# EAGLE design Lipmouse_Daughterboard_FSRextern (EAGLE 6.6.0)
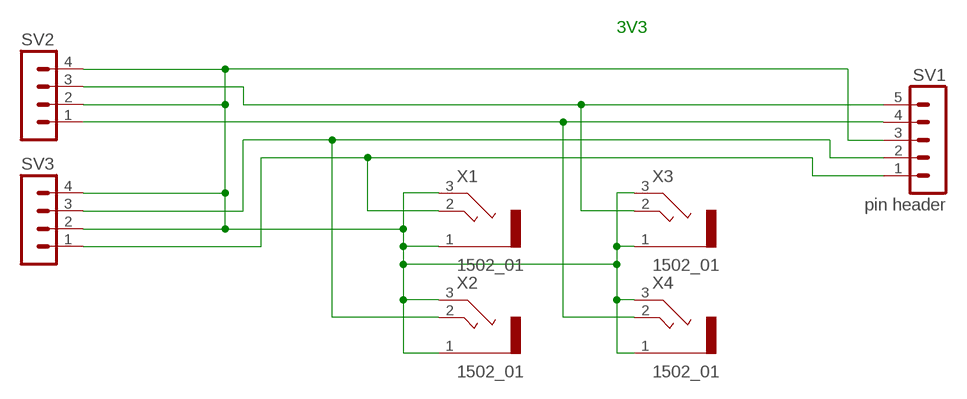
[diagram p0: schematic, sheet 1]

## Parts
SV1  pin header  MA05-1  [MA05-1]
SV2  MA04-1  [MA04-1]
SV3  MA04-1  [MA04-1]
X1  1502_01  [1502_01]
X2  1502_01  [1502_01]
X3  1502_01  [1502_01]
X4  1502_01  [1502_01]

## Nets
3V3: SV1.3 SV2.2 SV2.4 SV3.2 SV3.4 X1.1 X1.3 X2.1 X2.3 X3.1 X3.3 X4.1 X4.3
N$1: SV1.4 SV2.1 X4.2
N$2: SV1.5 SV2.3 X3.2
N$22: SV1.2 SV3.3 X2.2
N$23: SV1.1 SV3.1 X1.2

## Notes on the sheet
- 3V3

## Library data of the parts
SV1 = con-lstb:MA05-1: PIN HEADER; OC_FARNELL: unknown; OC_NEWARK: unknown
SV2 SV3 = con-lstb:MA04-1: PIN HEADER; OC_FARNELL: unknown; OC_NEWARK: unknown
X1-X4 = con-lumberg:1502_01: Jack connectors according to JISC 6560, 3.5 mm Klinkensteckverbinder nach JISC 6560, 3,5 mm Source: http://www.lumberg.com/Produkte/PDFs/1502_01.pdf; OC_FARNELL: 4739747; OC_NEWARK: unknown

## Board
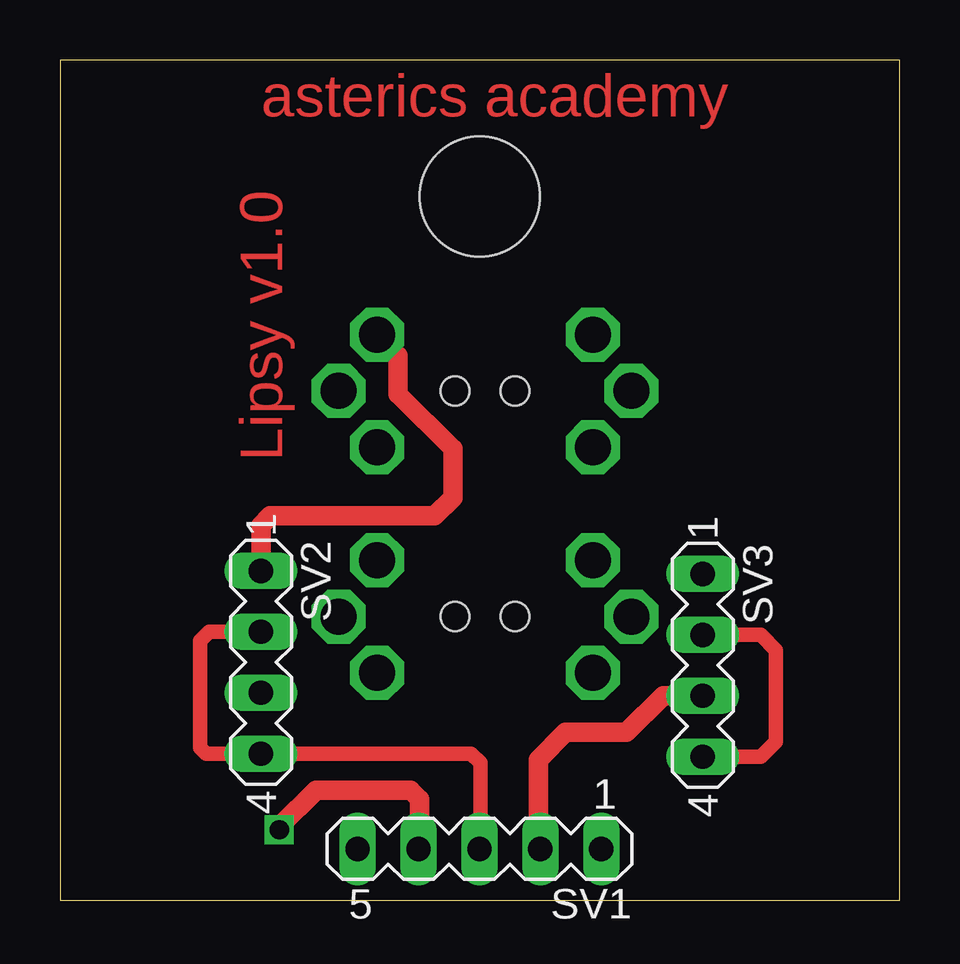
[diagram p1: board, top side]
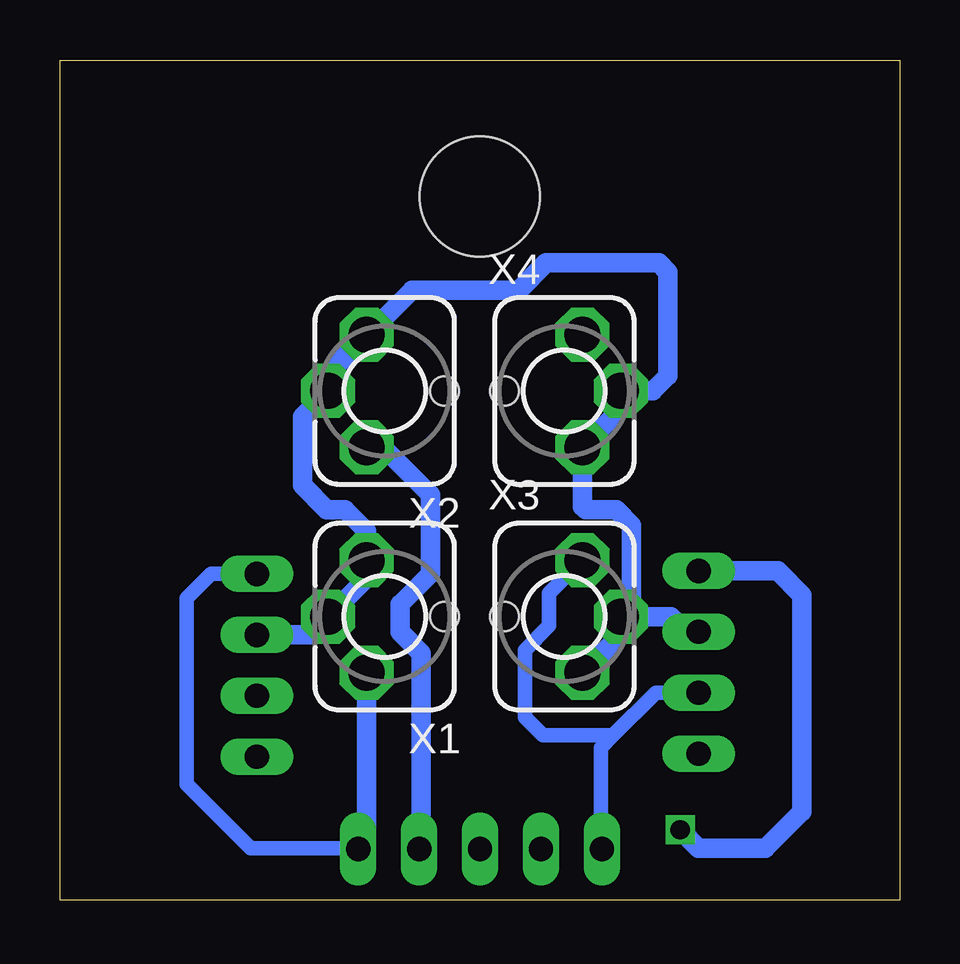
[diagram p2: board, bottom side, seen from below]

Size 35 x 35 mm. Coordinates in mm from the lower left corner, seen from the top.
Outline: 0,0 35,0 35,35 0,35 0,0
Copper layers (1*16): Top 0.035mm / dielectric 1.5mm / Bottom 0.035mm
Design rules "default *": minimum track width 10mil, minimum drill 0.6mm, track to track 8mil, track to pad 8mil, pad to pad 8mil, via to via 8mil, smd to smd 8mil, copper to edge 10mil, drill to drill 8mil, minimum pad ring 6mil, minimum via ring 8mil, stop-mask expansion 4mil, vias tented up to drill 0mil, thermal gap 10mil
Holes 5 mm at 17.5,29.31

### Footprints (pad centres in the part's own frame; a part is rotated, then mirrored left to right if it is on the bottom)
MA05-1 = drill 1.016 long: 1 -5.08,0; 2 -2.54,0; 3 0,0; 4 2.54,0; 5 5.08,0
MA04-1 = drill 1.016 long: 1 -3.81,0; 2 -1.27,0; 3 1.27,0; 4 3.81,0
1502_01 = drill 1.5 pad 1.9 octagon: 1 0,2.35; 2 -2.35,0.75; 3 2.35,0.75 | hole 1.2: 0,-2.5

### Placement (x,y rotation side)
SV1  17.49,2.13 180 top
SV2  8.38,9.91 270 top
SV3  26.8,9.78 270 top
X1  21.46,11.81 90 bottom
X2  21.46,21.21 90 bottom
X3  13.97,11.81 270 bottom
X4  13.97,21.21 270 bottom

### Tracks (layer width: path | path; a pad name or v marks a point on that pad's centre or on a via)
3V3
  Top 0.61: SV2.2 6.22,11.18 5.84,10.79 5.84,6.35 6.1,6.1 SV2.4 17.14,6.1 17.53,5.71 17.53,2.17 SV1.3 | SV3.2 29.21,11.05 29.84,10.41 29.84,6.6 29.21,5.97 SV3.4
  Bottom 0.61: 17.53,2.17 SV1.3
  Bottom 0.813: X2.1 23.81,21.96 X2.3 | X2.1 23.81,21.91 20.32,25.4 15.88,25.4 14.73,26.54 10.03,26.54 9.65,26.16 9.65,21.84 10.29,21.21 X4.1 11.62,20.46 X4.3 13.22,16.39 13.08,16.26 11.81,16.26 11.18,15.62 11.18,12.26 X3.1 | SV3.2 24.57,11.05 X1.1 22.21,13.41 X1.3 22.21,15.36 23.11,16.26 23.88,16.26 24.89,17.27 24.89,20.13 X2.1 | X3.1 11.62,11.06 X3.3 | X3.1 9.53,11.81 8.89,11.18 SV2.2
N$1  (via drill 0.8)
  Top 0.813: v9.14,2.92 9.14,3.05 10.67,4.57 14.61,4.57 14.99,4.19 14.99,2.17 SV1.4 | SV2.1 8.38,15.62 8.76,16 15.62,16 16.38,16.76 16.38,18.8 14.1,21.08 14.1,22.68 X4.2
  Bottom 0.813: SV2.1 5.08,13.72 4.06,12.7 4.06,3.68 5.59,2.16 8.38,2.16 v9.14,2.92
N$2
  Bottom 0.61: SV2.3 10.16,8.64 11.94,6.86 | 11.94,6.86 12.45,6.35 12.45,2.17 SV1.5 | 11.94,6.86 14.86,6.86 15.62,7.62 15.62,10.41 14.61,11.43 14.61,12.78 X3.2
N$22
  Top 0.813: SV3.3 25.15,8.51 23.62,6.99 21.08,6.99 19.94,5.84 19.94,2.22 SV1.2
  Bottom 0.813: X2.2 21.53,18.86 19.56,16.89 19.56,13.59 20.83,12.32 20.83,11.18 19.94,10.29 19.94,2.22 SV1.2
N$23
  Bottom 0.61: SV3.1 28.7,13.59 29.72,12.57 29.72,4.83 27.05,2.16 22.59,2.16 SV1.1
  Bottom 0.813: X1.2 22.21,2.49 SV1.1

### Text on the board
Top: asterics academy | Lipsy v1.0